# EAGLE design 4x4_keyboard_2.1 (EAGLE 9.6.2)
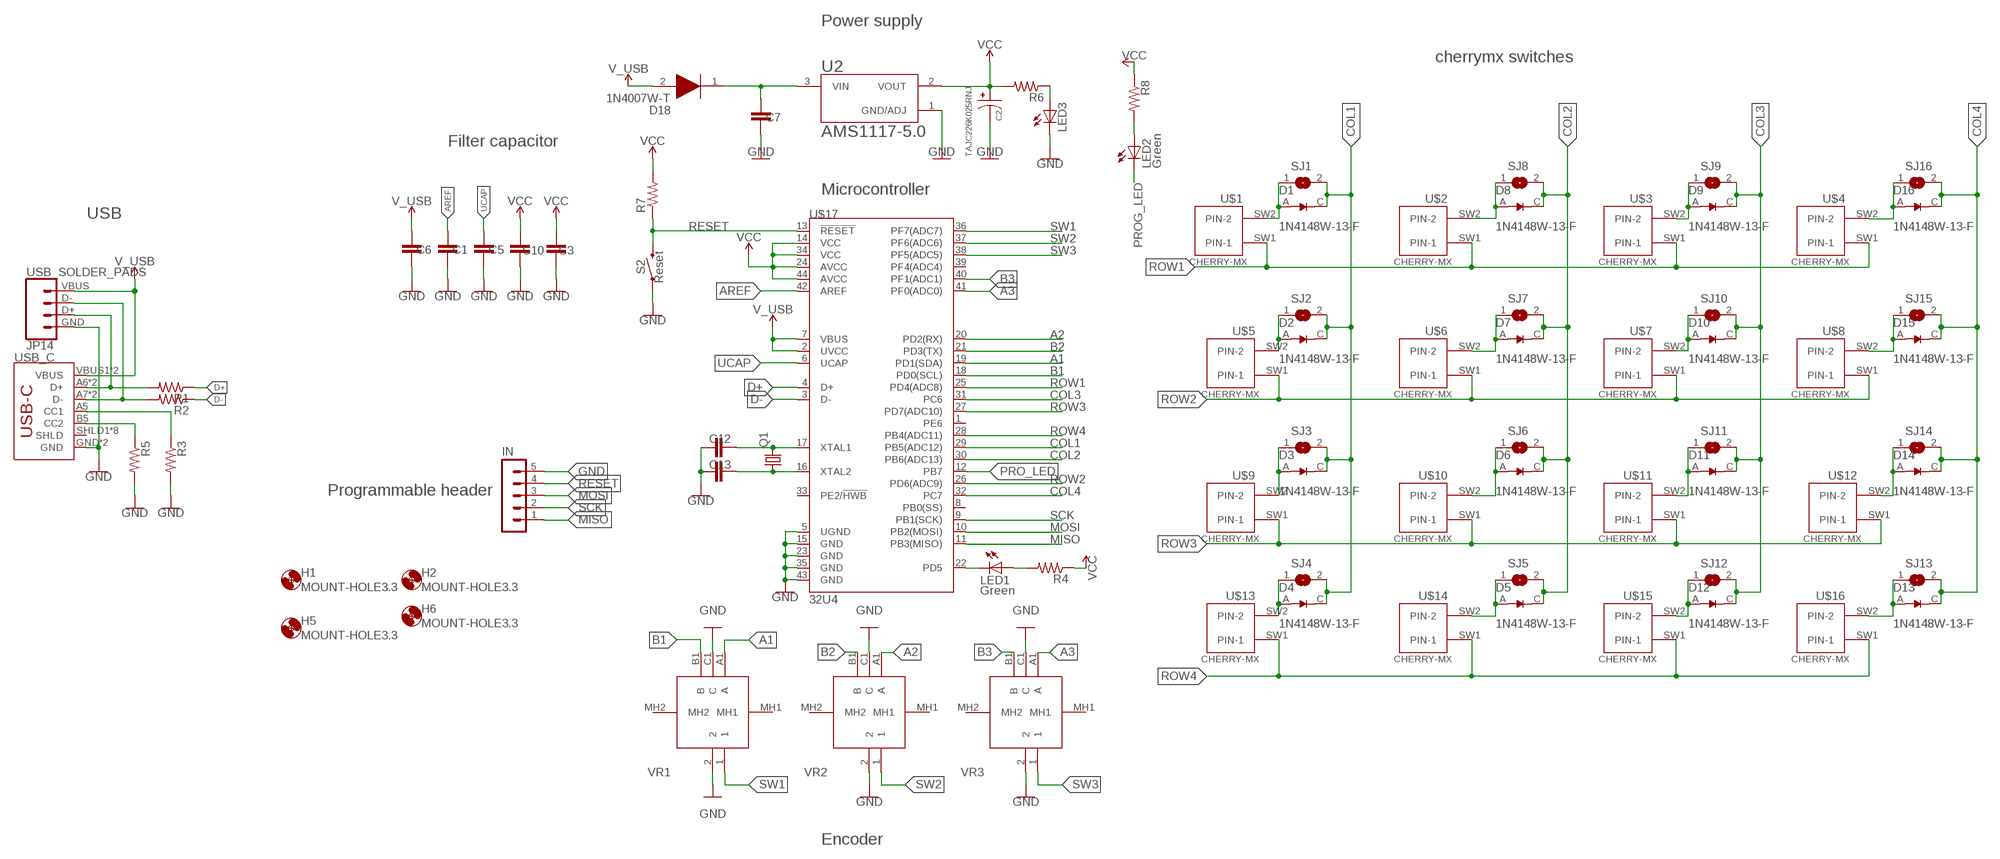
[diagram p0: schematic, sheet 1]

## Parts
C1  0.1uF  C-EUC0603  [C0603]
C2  TAJC226K025RNJ  [CAPPM6032X280N]
C3  0.1uF  C-EUC0603  [C0603]
C5  1.0uF  C-EUC0603  [C0603]
C6  1.0uF  C-EUC0603  [C0603]
C7  10uF  C-EUC0603  [C0603]
C10  1.0uF  C-EUC0603  [C0603]
C12  22pF  C-EUC0603  [C0603]
C13  22pF  C-EUC0603  [C0603]
D1  1N4148W-13-F  [SOD3715X135N]
D2  1N4148W-13-F  [SOD3715X135N]
D3  1N4148W-13-F  [SOD3715X135N]
D4  1N4148W-13-F  [SOD3715X135N]
D5  1N4148W-13-F  [SOD3715X135N]
D6  1N4148W-13-F  [SOD3715X135N]
D7  1N4148W-13-F  [SOD3715X135N]
D8  1N4148W-13-F  [SOD3715X135N]
D9  1N4148W-13-F  [SOD3715X135N]
D10  1N4148W-13-F  [SOD3715X135N]
D11  1N4148W-13-F  [SOD3715X135N]
D12  1N4148W-13-F  [SOD3715X135N]
D13  1N4148W-13-F  [SOD3715X135N]
D14  1N4148W-13-F  [SOD3715X135N]
D15  1N4148W-13-F  [SOD3715X135N]
D16  1N4148W-13-F  [SOD3715X135N]
D18  1N4007W-T  [SODFL3818X130N]
H1  MOUNT-HOLE3.3  [3,3]
H2  MOUNT-HOLE3.3  [3,3]
H5  MOUNT-HOLE3.3  [3,3]
H6  MOUNT-HOLE3.3  [3,3]
IN  MA05-1  [MA05-1]
JP14  USB_SOLDER_PADS  [USB-SOLDER-PADS]
LED1  Green  LEDSML0805  [SML0805]
LED2  Green  LEDSML0805  [SML0805]
LED3  LEDSML0805  [SML0805]
Q1  CRYSTALHC49UP  [HC49UP]
R1  5.1k  R-US_R0603  [R0603]
R2  5.1k  R-US_R0603  [R0603]
R3  5.1k  R-US_R0603  [R0603]
R4  1K  R-US_R0603  [R0603]
R5  5.1k  R-US_R0603  [R0603]
R6  1K  R-US_R0603  [R0603]
R7  1K  R-US_R0603  [R0603]
R8  1K  R-US_R0603  [R0603]
S2  Reset  MOMENTARY-SWITCH-SPST-SMD-4.6X2.8MM  [TACTILE_SWITCH_SMD_4.6X2.8MM]
SJ1  SJ  [SJ]
SJ2  SJ  [SJ]
SJ3  SJ  [SJ]
SJ4  SJ  [SJ]
SJ5  SJ  [SJ]
SJ6  SJ  [SJ]
SJ7  SJ  [SJ]
SJ8  SJ  [SJ]
SJ9  SJ  [SJ]
SJ10  SJ  [SJ]
SJ11  SJ  [SJ]
SJ12  SJ  [SJ]
SJ13  SJ  [SJ]
SJ14  SJ  [SJ]
SJ15  SJ  [SJ]
SJ16  SJ  [SJ]
U2  AMS1117-5.0  [SOT229P700X180-4N]
U$1  CHERRY-MX  [CHERRY-MX]
U$2  CHERRY-MX  [CHERRY-MX]
U$3  CHERRY-MX  [CHERRY-MX]
U$4  CHERRY-MX  [CHERRY-MX]
U$5  CHERRY-MX  [CHERRY-MX]
U$6  CHERRY-MX  [CHERRY-MX]
U$7  CHERRY-MX  [CHERRY-MX]
U$8  CHERRY-MX  [CHERRY-MX]
U$9  CHERRY-MX  [CHERRY-MX]
U$10  CHERRY-MX  [CHERRY-MX]
U$11  CHERRY-MX  [CHERRY-MX]
U$12  CHERRY-MX  [CHERRY-MX]
U$13  CHERRY-MX  [CHERRY-MX]
U$14  CHERRY-MX  [CHERRY-MX]
U$15  CHERRY-MX  [CHERRY-MX]
U$16  CHERRY-MX  [CHERRY-MX]
U$17  32U4  ATMEGA32U4TQFP-44  [TQFP44]
USB_C  USB_C5  [USB-C-16P-5]
VR1  PEC11R-4220F-S0024  [PEC11R4220FS0024]
VR2  PEC11R-4220F-S0024  [PEC11R4220FS0024]
VR3  PEC11R-4220F-S0024  [PEC11R4220FS0024]

## Nets
A1: U$17.19(PD1(SDA)) VR1.A1(A)
A2: U$17.20(PD2(RX)) VR2.A1(A)
A3: U$17.41(PF0(ADC0)) VR3.A1(A)
AREF: C1.2 U$17.42(AREF)
B1: U$17.18(PD0(SCL)) VR1.B1(B)
B2: U$17.21(PD3(TX)) VR2.B1(B)
B3: U$17.40(PF1(ADC1)) VR3.B1(B)
COL1: D1.C(K) D2.C(K) D3.C(K) D4.C(K) SJ1.2 SJ2.2 SJ3.2 SJ4.2 U$17.29(PB5(ADC12))
COL2: D5.C(K) D6.C(K) D7.C(K) D8.C(K) SJ5.2 SJ6.2 SJ7.2 SJ8.2 U$17.30(PB6(ADC13))
COL3: D9.C(K) D10.C(K) D11.C(K) D12.C(K) SJ9.2 SJ10.2 SJ11.2 SJ12.2 U$17.31(PC6)
COL4: D13.C(K) D14.C(K) D15.C(K) D16.C(K) SJ13.2 SJ14.2 SJ15.2 SJ16.2 U$17.32(PC7)
D+: R1.1 U$17.4(D+)
D-: R2.1 U$17.3(D-)
D-_HV: JP14.D- R2.2 USB_C.A7(D-) USB_C.B7(D-)
DP_HV: JP14.D+ R1.2 USB_C.A6(D+) USB_C.B6(D+)
GND: C1.1 C2.2 C3.1 C5.1 C6.1 C7.1 C10.1 C12.2 C13.2 IN.5 JP14.GND LED3.C R3.2 R5.2 S2.1 S2.2 U2.1(GND/ADJ) U$17.5(UGND) U$17.15(GND) U$17.23(GND) U$17.35(GND) U$17.43(GND) USB_C.GND USB_C.GND2(GND) VR1.2 VR1.C1(C) VR2.2 VR2.C1(C) VR3.2 VR3.C1(C)
MISO: IN.1 U$17.11(PB3(MISO))
MOSI: IN.3 U$17.10(PB2(MOSI))
N$2: LED1.C U$17.22(PD5)
N$3: D3.A SJ3.1 U$9.SW2(PIN-2)
N$4: C7.2 D18.1(K) U2.3(VIN)
N$5: LED1.A R4.2
N$6: D4.A SJ4.1 U$13.SW2(PIN-2)
N$7: R3.1 USB_C.A5(CC1)
N$8: D16.A SJ16.1 U$4.SW2(PIN-2)
N$9: D11.A SJ11.1 U$11.SW2(PIN-2)
N$10: D15.A SJ15.1 U$8.SW2(PIN-2)
N$11: LED3.A R6.1
N$12: D14.A SJ14.1 U$12.SW2(PIN-2)
N$13: R5.1 USB_C.B5(CC2)
N$14: D13.A SJ13.1 U$16.SW2(PIN-2)
N$15: D12.A SJ12.1 U$15.SW2(PIN-2)
N$16: LED2.A R8.2
N$17: D10.A SJ10.1 U$7.SW2(PIN-2)
N$19: D9.A SJ9.1 U$3.SW2(PIN-2)
N$20: D5.A SJ5.1 U$14.SW2(PIN-2)
N$21: D2.A SJ2.1 U$5.SW2(PIN-2)
N$22: D6.A SJ6.1 U$10.SW2(PIN-2)
N$23: D7.A SJ7.1 U$6.SW2(PIN-2)
N$24: C13.1 Q1.1 U$17.16(XTAL2)
N$25: D8.A SJ8.1 U$2.SW2(PIN-2)
N$26: D1.A SJ1.1 U$1.SW2(PIN-2)
N$27: C12.1 Q1.2 U$17.17(XTAL1)
PRO_LED: U$17.12(PB7)
PROG_LED: LED2.C
RESET: IN.4 R7.1 S2.3 S2.4 U$17.13(!RESET)
ROW1: U$1.SW1(PIN-1) U$2.SW1(PIN-1) U$3.SW1(PIN-1) U$4.SW1(PIN-1) U$17.25(PD4(ADC8))
ROW2: U$5.SW1(PIN-1) U$6.SW1(PIN-1) U$7.SW1(PIN-1) U$8.SW1(PIN-1) U$17.26(PD6(ADC9))
ROW3: U$9.SW1(PIN-1) U$10.SW1(PIN-1) U$11.SW1(PIN-1) U$12.SW1(PIN-1) U$17.27(PD7(ADC10))
ROW4: U$13.SW1(PIN-1) U$14.SW1(PIN-1) U$15.SW1(PIN-1) U$16.SW1(PIN-1) U$17.28(PB4(ADC11))
SCK: IN.2 U$17.9(PB1(SCK))
SW1: U$17.36(PF7(ADC7)) VR1.1
SW2: U$17.37(PF6(ADC6)) VR2.1
SW3: U$17.38(PF5(ADC5)) VR3.1
UCAP: C5.2 U$17.6(UCAP)
V_USB: C6.2 D18.2(A) JP14.VBUS U$17.2(UVCC) U$17.7(VBUS) USB_C.VBUS1(VBUS) USB_C.VBUS2(VBUS)
VCC: C2.1 C3.2 C10.2 R4.1 R6.2 R7.2 R8.1 U2.2(VOUT) U$17.14(VCC) U$17.24(AVCC) U$17.34(VCC) U$17.44(AVCC)
Unconnected: U$17.1(PE6) U$17.8(PB0(SS)) U$17.33(PE2/!HWB) U$17.39(PF4(ADC4)) USB_C.SHLD1(SHLD) USB_C.SHLD2(SHLD) USB_C.SHLD3(SHLD) USB_C.SHLD4(SHLD) USB_C.SHLD5(SHLD) USB_C.SHLD6(SHLD) USB_C.SHLD7(SHLD) USB_C.SHLD8(SHLD) VR1.MH1 VR1.MH2 VR2.MH1 VR2.MH2 VR3.MH1 VR3.MH2

## Notes on the sheet
- Power supply
- cherrymx switches
- Filter capacitor
- Microcontroller
- USB
- Programmable header
- Encoder

## Library data of the parts
C1 C3 C5-C7 C10 C12 C13 = rcl:C-EU: CAPACITOR, European symbol; SPICEPREFIX: C
C2 = TAJC226K025RNJ:TAJC226K025RNJ: 47µF Molded Tantalum Capacitors 16V 2312 (6032 Metric) 500mOhm Check availability <https://pricing.snapeda.com/parts/TAJC226K025RNJ/AVX%20Interconnect%20/%20Elco/view-part?ref=eda>; AVAILABILITY: In Stock; DESCRIPTION: 22 µF Molded Tantalum Capacitors 25 V 2312 (6032 Metric) 1.4Ohm; MF: AVX Interconnect / Elco; MP: TAJC226K025RNJ; PACKAGE: 2312 AVX Interconnect / Elco; PRICE: None; PURCHASE-URL: https://pricing.snapeda.com/search/part/TAJC226K025RNJ/?ref=eda
D1-D16 = 1N4148W-13-F:1N4148W-13-F: 1N4148W Series 2 A 100 V 400 mW Surface Mount Fast Switching Diode - SOD-123 Check prices <https://pricing.snapeda.com/parts/1N4148W-13-F/Diodes%20Inc./view-part?ref=eda>; AVAILABILITY: In Stock; DESCRIPTION: Diode Standard 100 V 150mA Surface Mount SOD-123; MF: Diodes Inc.; MP: 1N4148W-13-F; PACKAGE: SOD-123 Fairchild Semiconductor; PRICE: None; PURCHASE-URL: https://pricing.snapeda.com/search/part/1N4148W-13-F/?ref=eda
D18 = 1N4007W-T:1N4007W-T: Rectifiers SOD-123,1A,1000V,GP Source: Datasheet <https://www.mouser.cn/datasheet/2/345/1n4001w_1n4007w-2449105.pdf>; ARROW_PART_NUMBER: 1N4007W-T; ARROW_PRICE-STOCK: https://www.arrow.com/en/products/1n4007w-t/rectron?region=nac; DESCRIPTION: Rectifiers SOD-123,1A,1000V,GP; HEIGHT: 1.3mm; MANUFACTURER_NAME: Rectron; MANUFACTURER_PART_NUMBER: 1N4007W-T; MOUSER_PART_NUMBER: 583-1N4007W-T; MOUSER_PRICE-STOCK: https://www.mouser.co.uk/ProductDetail/Rectron/1N4007W-T?qs=QNEnbhJQKvah3J4JbJr%2FPw%3D%3D
H1 H2 H5 H6 = holes:MOUNT-HOLE: MOUNTING HOLE with drill center marker
IN = con-lstb:MA05-1: PIN HEADER; OC_FARNELL: unknown; OC_NEWARK: unknown
JP14 = SparkFun-Connectors:USB_SOLDER_PADS: Solder pad access to USB pins. Helpful to expose on PCBs so user can attach external USB connector if necessary.
LED1-LED3 = led:LED: LED OSRAM: - CHIPLED LG R971, LG N971, LY N971, LG Q971, LY Q971, LO R971, LY R971 LH N974, LH R974 LS Q976, LO Q976, LY Q976 LO Q996 - Hyper CHIPLED LW Q18S LB Q993, LB Q99A, LB R99A - SideLED LS A670, LO A670, LY A670, LG A670, LP A670 LB A673, LV A673, LT A673, LW A673 LH A674 LY A675 LS A676, LA A676, LO A676, LY A676, LW A676 LS A679, LY A679, LG A679 - Hyper Micro SIDELED® LS Y876, LA Y876, LO Y876, LY Y876 LT Y87S - SmartLED LW L88C, LW L88S LB L89C, LB L89S, LG L890 LS L89K, LO L89K, LY L89K LS L896, LA L896, LO L896, LY L896 - TOPLED LS T670, LO T670, LY T670, LG T670, LP T670 LSG T670, LSP T670, LSY T670, LOP T670, LYG T670 LG T671, LOG T671, LSG T671 LB T673, LV T673, LT T673, LW T673 LH T674 LS T676, LA T676, LO T676, LY T676, LB T676, LH T676, LSB T676, LW T676 LB T67C, LV T67C, LT T67C, LS T67K, LO T67K, LY T67K, LW E67C LS E67B, LA E67B, LO E67B, LY E67B, LB E67C, LV E67C, LT E67C LW T67C LS T679, LY T679, LG T679 LS T770, LO T770, LY T770, LG T770, LP T770 LB T773, LV T773, LT T773, LW T773 LH T774 LS E675, LA E675, LY E675, LS T675 LS T776, LA T776, LO T776, LY T776, LB T776 LHGB T686 LT T68C, LB T68C - Hyper Mini TOPLED® LB M676 - Mini TOPLED Santana® LG M470 LS M47K, LO M47K, LY M47K Source: http://www.osram.convergy.de LUXEON: - LUMILED® LXK2-PW12-R00, LXK2-PW12-S00, LXK2-PW14-U00, LXK2-PW14-V00 LXK2-PM12-R00, LXK2-PM12-S00, LXK2-PM14-U00 LXK2-PE12-Q00, LXK2-PE12-R00, LXK2-PE12-S00, LXK2-PE14-T00, LXK2-PE14-U00 LXK2-PB12-K00, LXK2-PB12-L00, LXK2-PB12-M00, LXK2-PB14-N00, LXK2-PB14-P00, LXK2-PB14-Q00 LXK2-PR12-L00, LXK2-PR12-M00, LXK2-PR14-Q00, LXK2-PR14-R00 LXK2-PD12-Q00, LXK2-PD12-R00, LXK2-PD12-S00 LXK2-PH12-R00, LXK2-PH12-S00 LXK2-PL12-P00, LXK2-PL12-Q00, LXK2-PL12-R00 Source: www.luxeon.com KINGBRIGHT: KA-3528ASYC Source: www.kingbright.com
Q1 = crystal:CRYSTAL: CRYSTAL; OC_FARNELL: unknown; OC_NEWARK: unknown
R1-R8 = audio amplifier example:R-US_: RESISTOR, American symbol
S2 = SparkFun-Switches:MOMENTARY-SWITCH-SPST: Momentary Switch (Pushbutton) - SPST Normally-open (NO) SPST momentary switches (buttons, pushbuttons). Variants PTH-12MM - 12mm square, through-hole Momentary Pushbutton Switch - 12mm Square <https://www.sparkfun.com/products/9190> (COM-09190) PTH-6.0MM, PTH-6.0MM-KIT - 6.0mm square, through-hole Mini Pushbutton Switch <https://www.sparkfun.com/products/97> (COM-00097) KIT package intended for soldering kit's - only one side of pads' copper is exposed. PTH-RIGHT-ANGLE-KIT - Right-angle, through-hole Right Angle Tactile Button <https://www.sparkfun.com/products/10791> - Used on SparkFun BigTime Watch Kit <https://www.sparkfun.com/products/11734> SMD-12MM - 12mm square, surface-mount Tactile Button - SMD (12mm) <https://www.sparkfun.com/products/12993> (COM-12993) Used on SparkFun PicoBoard <https://www.sparkfun.com/products/11888> SMD-4.5MM - 4.5mm Square Trackball Switch Used on SparkFun Blackberry Trackballer Breakout <https://www.sparkfun.com/products/13169> SMD-4.6MMX2.8MM - 4.60mm x 2.80mm, surface mount Used on SparkFun SAMD21 Mini Breakout <https://www.sparkfun.com/products/13664> SMD-5.2MM, SMD-5.2-REDUNDANT - 5.2mm square, surface-mount Mini Pushbutton Switch - SMD <https://www.sparkfun.com/products/8720> (COM-08720) Used on Arduino Pro Mini <https://www.sparkfun.com/products/11114> REDUNDANT package connects both switch circuits together SMD-6.0X3.5MM - 6.0 x 3.5mm, surface mount Momentary Reset Switch SMD <https://www.sparkfun.com/products/8229> (COM-08229) SMD-6.2MM-TALL - 6.2mm square, surface mount Tactile Button - SMD (6mm) <https://www.sparkfun.com/products/12992> Used on SparkFun Digital Sandbox <https://www.sparkfun.com/products/12651> SMD-RIGHT-ANGLE - Right-angle, surface mount Used on SparkFun Block for Intel® Edison - Arduino <https://www.sparkfun.com/products/13036>; PROD_ID: SWCH-13065
SJ1-SJ16 = jumper:SJ: SMD solder JUMPER
U2 = AMS1117-5.0:AMS1117-5.0: Check availability <https://pricing.snapeda.com/parts/AMS1117-5.0/Advanced%20Monolithic%20Systems/view-part?ref=eda>; AVAILABILITY: Not in stock; DESCRIPTION: Sot223/Pkg 1-Amp 5-Volt Low Drop Out Voltage Regulatator; MF: Advanced Monolithic Systems; MP: AMS1117-5.0; PACKAGE: SOT-223 Seeed Technology; PRICE: None
U$1-U$16 = cherrymx:CHERRY-MX: Cherry MX series keyswitch
U$17 = SparkFun-IC-Microcontroller:ATMEGA32U4: Atmel MCU, 32KByte Atmel 44-pin 8-bit Microcontroller with 32KBytes of ISP Flash and USB Controller Datasheet <http://cdn.sparkfun.com/datasheets/Dev/Arduino/Boards/ATMega32U4.pdf> SparkFun Products LilyPad Arduino USB - ATmega32U4 Board <https://www.sparkfun.com/products/12049> (DEV-12049) Pro Micro - 5V/16MHz <https://www.sparkfun.com/products/12640> (DEV-12640) Pro Micro - 3.3V/8MHz <https://www.sparkfun.com/products/12587> (DEV-12587) Fio v3 - ATmega32U4 <https://www.sparkfun.com/products/11520> (DEV-11520) Qduino Mini <https://www.sparkfun.com/products/13614> (DEV-13614) Makey Makey - Standard Kit <https://www.sparkfun.com/products/11511> (WIG-11511) Makey Makey Deluxe Kit <https://www.sparkfun.com/products/11519> (WIG-11519); PROD_ID: IC-11161
USB_C = USBC:USB_C: USB Type C 16Pin Connector Super Speed pins not available on the 16-pin purely SMD connector so this part is best for USB 2.0 implementations. D1 and D2 are tied together enabling D+/- no matter which way the cable is plugged into the connector. The two channel configuration pins (CC1/2) are exposed. These are normally connected to ground via 5.1k resistors but can be reconfigured for high current/high power applications.
VR1-VR3 = PEC11R-4220F-S0024-RotaryEncoder:PEC11R-4220F-S0024: Bourns 24 Pulse Incremental Mechanical Rotary Encoder with a 6 mm Flat Shaft (Not Indexed), Through Hole Source: Datasheet <http://uk.rs-online.com/web/p/products/7377767P>; ALLIED_NUMBER: 70276555; DESCRIPTION: Bourns 24 Pulse Incremental Mechanical Rotary Encoder with a 6 mm Flat Shaft (Not Indexed), Through Hole; HEIGHT: 27.5mm; MANUFACTURER_NAME: Bourns; MANUFACTURER_PART_NUMBER: PEC11R-4220F-S0024; RS_PART_NUMBER: 7377767P; RS_PRICE-STOCK: http://uk.rs-online.com/web/p/products/7377767P

## Board
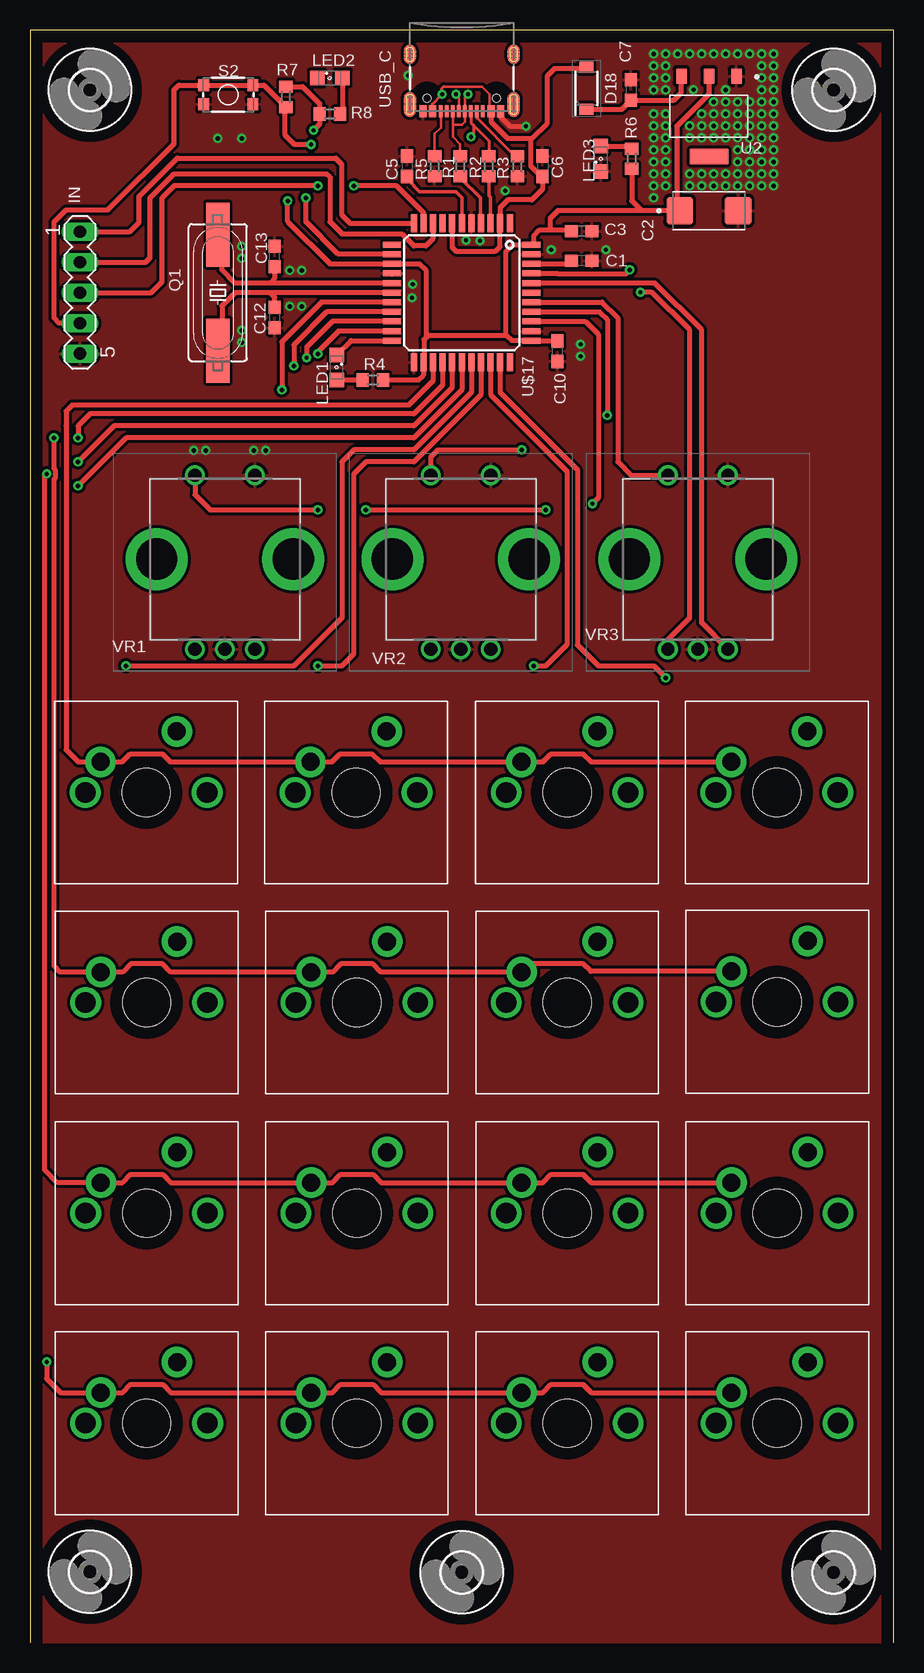
[diagram p1: board, top side]
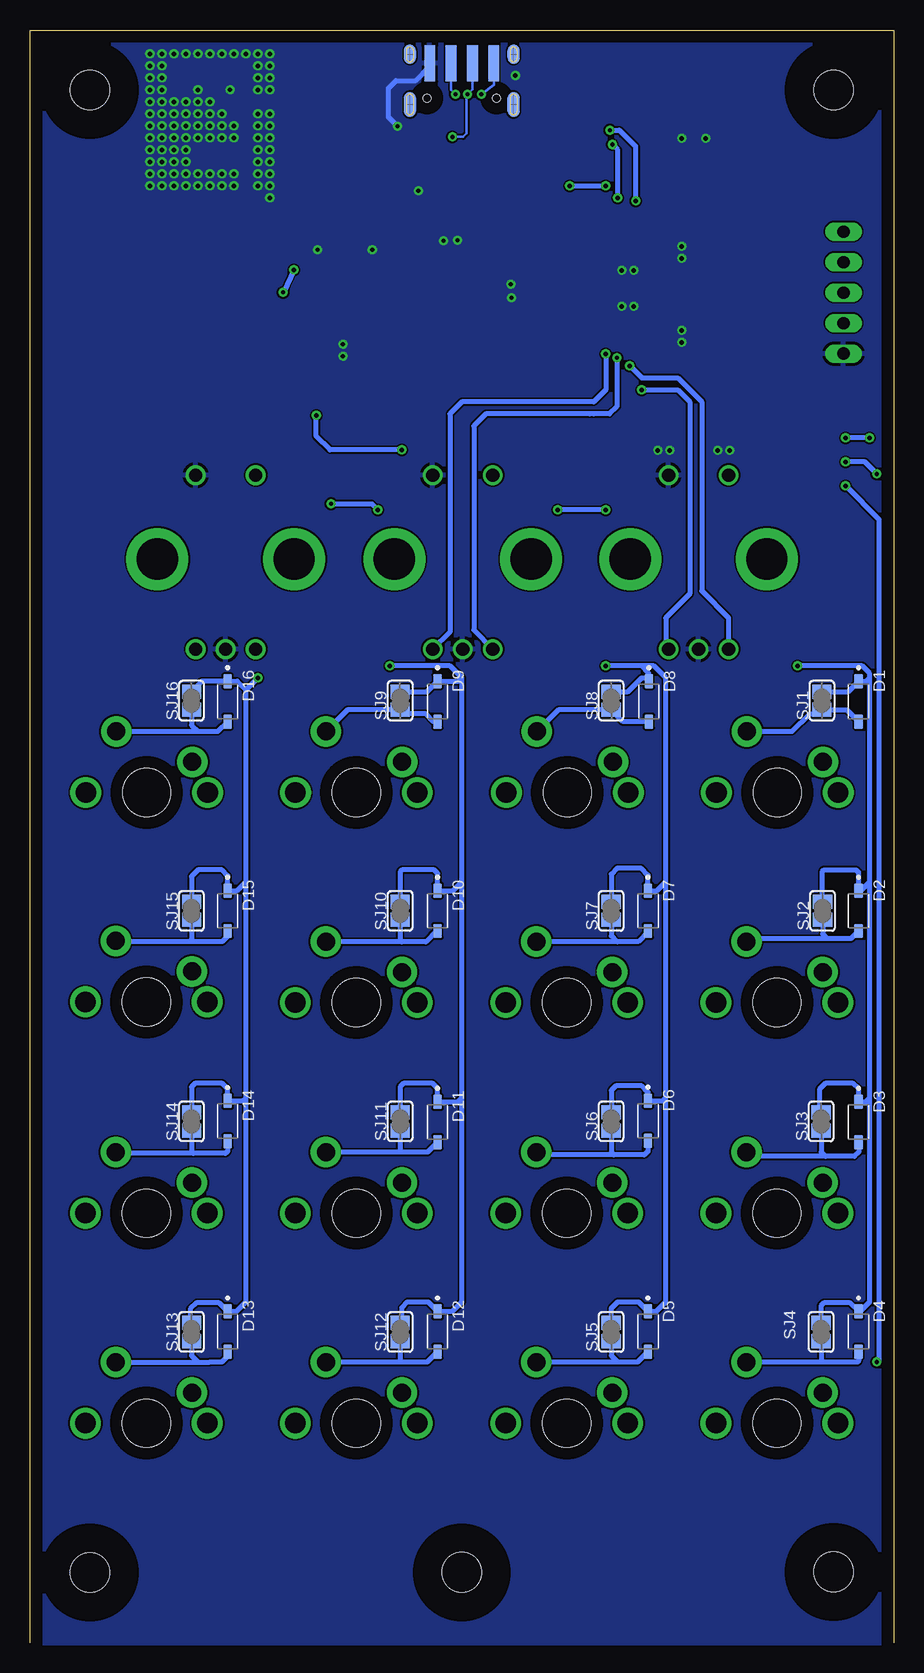
[diagram p2: board, bottom side, seen from below]

Size 72 x 134.4 mm. Coordinates in mm from the lower left corner, seen from the top.
Outline: 72,0 72,134.4 0,134.4 0,0
Copper layers (1*16): Top 0.035mm / dielectric 1.5mm / Bottom 0.035mm
Design rules "default": minimum track width 6mil, minimum drill 0.35mm, track to track 6mil, track to pad 6mil, pad to pad 6mil, via to via 6mil, smd to smd 6mil, copper to edge 40mil, drill to drill 6mil, minimum pad ring 10mil, minimum via ring 8mil, stop-mask expansion 4mil, vias tented up to drill 0mil, thermal gap 10mil

### Footprints (pad centres in the part's own frame; a part is rotated, then mirrored left to right if it is on the bottom)
C0603 = smd 1.1 x 1: 1 -0.85,0; 2 0.85,0
CAPPM6032X280N = smd 2.24 x 2.32: 1 -2.435,0; 2 2.435,0
SOD3715X135N = smd 1.21 x 0.73: A 1.68,0; C -1.68,0
SODFL3818X130N = smd 0.92 x 1.13: 1 -1.75,0; 2 1.75,0
3,3 = hole 3.3: 0,0
MA05-1 = drill 1.016 long: 1 -5.08,0; 2 -2.54,0; 3 0,0; 4 2.54,0; 5 5.08,0
USB-SOLDER-PADS = smd 3 x 0.9: D+ 0,-0.889; D- 0,0.889; GND 0,-2.667; VBUS 0,2.667
SML0805 = smd 1.2 x 1.2: A 1.05,0; C -1.05,0
HC49UP = smd 5.334 x 1.93: 1 -4.826,0; 2 4.826,0
R0603 = smd 1 x 1.1: 1 -0.85,0; 2 0.85,0
TACTILE_SWITCH_SMD_4.6X2.8MM = smd 0.9 x 1: 1 -2.05,-0.8; 2 2.05,-0.8; 3 2.05,0.8; 4 -2.05,0.8
SJ = smd 1.168 x 1.6: 1 -0.762,0; 2 0.762,0
SOT229P700X180-4N = smd 0.93 x 1.31: 1 -2.29,-3.345; 2 0,-3.345; 3 2.29,-3.345 | smd 3.24 x 1.31: 4 0,3.345
CHERRY-MX = drill 1.714 pad 1.93: P$3 -5.08,0; P$4 5.08,0 | drill 1.5 pad 2.54: SW1 -3.81,2.54; SW2 2.54,5.08 | hole 4: 0,0
TQFP44 = smd 1.5 x 0.5: 1 -5.8,4; 2 -5.8,3.2; 3 -5.8,2.4; 4 -5.8,1.6; 5 -5.8,0.8; 6 -5.8,0; 7 -5.8,-0.8; 8 -5.8,-1.6; 9 -5.8,-2.4; 10 -5.8,-3.2; 11 -5.8,-4; 23 5.8,-4; 24 5.8,-3.2; 25 5.8,-2.4; 26 5.8,-1.6; 27 5.8,-0.8; 28 5.8,0; 29 5.8,0.8; 30 5.8,1.6; 31 5.8,2.4; 32 5.8,3.2; 33 5.8,4 | smd 0.5 x 1.5: 12 -4,-5.8; 13 -3.2,-5.8; 14 -2.4,-5.8; 15 -1.6,-5.8; 16 -0.8,-5.8; 17 0,-5.8; 18 0.8,-5.8; 19 1.6,-5.8; 20 2.4,-5.8; 21 3.2,-5.8; 22 4,-5.8; 34 4,5.8; 35 3.2,5.8; 36 2.4,5.8; 37 1.6,5.8; 38 0.8,5.8; 39 0,5.8; 40 -0.8,5.8; 41 -1.6,5.8; 42 -2.4,5.8; 43 -3.2,5.8; 44 -4,5.8
USB-C-16P-5 = smd 0.3 x 1: A5 -1.25,-0.34; A6 -0.25,-0.34; A7 0.25,-0.34; A8 1.25,-0.34; B5 1.75,-0.34; B6 0.75,-0.34; B7 -0.75,-0.34; B8 -1.75,-0.34 | smd 0.6 x 1: GND -3.225,-0.34; GND2 3.225,-0.34; VBUS1 -2.45,-0.34; VBUS2 2.45,-0.34 | smd 1 x 2.1: SHLD1 -4.32,-0.915; SHLD2 4.32,-0.915 | smd 1 x 2.1 bottom: SHLD3 -4.32,-0.915; SHLD4 4.32,-0.915 | smd 1 x 1.6: SHLD5 -4.32,-5.095; SHLD8 4.32,-5.095 | smd 1 x 1.6 bottom: SHLD6 -4.32,-5.095; SHLD7 4.32,-5.095 | hole 0.65: -2.89,-1.445; 2.89,-1.445
PEC11R4220FS0024 = drill 1.1 pad 1.65: 1 0,0; 2 5,0; A1 0,-14.5; B1 5,-14.5; C1 2.5,-14.5 | drill 3.441 pad 5.161: MH1 -3.2,-7; MH2 8.2,-7

### Placement (x,y rotation side)
C1  46,115.19 180 top
C2  56.61,119.34 0 top
C3  46,117.64 180 top
C5  31.43,123.05 270 top
C6  42.73,123.05 270 top
C7  50.11,129.41 270 top
C10  43.97,107.63 90 top
C12  20.4,110.45 270 top
C13  20.4,115.53 90 top
D1  2.92,78.45 270 bottom
D2  2.92,61 270 bottom
D3  2.92,43.4 270 bottom
D4  2.92,25.94 270 bottom
D5  20.48,25.94 270 bottom
D6  20.48,43.51 270 bottom
D7  20.48,61 270 bottom
D8  20.4,78.45 270 bottom
D9  38.02,78.45 270 bottom
D10  38.02,61 270 bottom
D11  38.02,43.41 270 bottom
D12  38.02,25.94 270 bottom
D13  55.52,25.94 270 bottom
D14  55.52,43.48 270 bottom
D15  55.52,61 270 bottom
D16  55.52,78.45 270 bottom
D18  46.4,129.54 90 top
H1  67,129.41 0 top
H2  5,129.41 0 top
H4  MOUNT-HOLE3.3  [3,3]  67,5.86 0 top
H5  5,5.92 0 top
H6  36,5.87 0 top
IN  4.17,112.52 270 top
JP14  36,131.62 270 bottom
LED1  25.57,106.27 270 top
LED2  25,130.41 0 top
LED3  47.59,123.67 90 top
Q1  15.66,112.52 270 top
R1  35.87,123.05 90 top
R2  38.25,123.05 90 top
R3  40.63,123.05 270 top
R4  28.59,105.24 180 top
R5  33.75,123.05 270 top
R6  50.17,123.67 270 top
R7  21.34,128.83 90 top
R8  25,127.41 0 top
S2  16.53,129.01 0 top
SJ1  5.97,78.51 90 bottom
SJ2  5.91,61 90 bottom
SJ3  6.04,43.45 90 bottom
SJ4  6.04,25.91 90 bottom
SJ5  23.54,25.91 90 bottom
SJ6  23.54,43.45 90 bottom
SJ7  23.54,61 90 bottom
SJ8  23.54,78.51 90 bottom
SJ9  41.13,78.51 90 bottom
SJ10  41.13,61 90 bottom
SJ11  41.13,43.45 90 bottom
SJ12  41.13,25.91 90 bottom
SJ13  58.53,25.91 90 bottom
SJ14  58.53,43.45 90 bottom
SJ15  58.53,61 90 bottom
SJ16  58.53,78.51 90 bottom
U2  56.61,127.21 180 top
U$1  9.69,70.86 0 top
U$2  27.2,70.86 0 top
U$3  44.78,70.86 0 top
U$4  62.27,70.86 0 top
U$5  9.72,53.36 0 top
U$6  27.25,53.36 0 top
U$7  44.79,53.36 0 top
U$8  62.3,53.41 0 top
U$9  9.72,35.81 0 top
U$10  27.25,35.81 0 top
U$11  44.79,35.81 0 top
U$12  62.3,35.81 0 top
U$13  9.72,18.31 0 top
U$14  27.25,18.31 0 top
U$15  44.79,18.31 0 top
U$16  62.3,18.31 0 top
U$17  36,112.52 270 top
USB_C  36,127.28 180 top
VR1  13.75,97.31 0 top
VR2  33.42,97.31 0 top
VR3  53.18,97.31 0 top

### Tracks (layer width: path | path; a pad name or v marks a point on that pad's centre or on a via)
A1  (via drill 0.35)
  Top 0.406: U$17.19 24.75,110.92 22,108.17 v22,106.41
  Bottom 0.406: VR1.A1 13.75,85.41 16,87.66 16,103.41 18,105.41 21,105.41 v22,106.41
A2  (via drill 0.35)
  Top 0.406: v23.07,107.08 23.07,107.97 25.22,110.12 U$17.20
  Bottom 0.406: VR2.A1 35,84.39 35,101.41 34,102.41 25.35,102.41 25,102.41 23.67,102.41 23.07,103.01 v23.07,107.08
A3  (via drill 0.35)
  Top 0.406: VR3.A1 53.18,83.59 55,85.41 55,109.41 51.87,112.54 v50.91,112.54 | U$17.41 43.99,114.12 44.03,114.08 49.67,114.08 v50,114.41
  Bottom 0.406: v50.91,112.54 50.87,112.54 v50,114.41
AREF
  Top 0.406: U$17.42 44.7,114.92 C1.2
B1  (via drill 0.35)
  Top 0.406: U$17.18 24.31,111.72 21,108.41 v21,104.41
  Bottom 0.406: VR1.B1 19,83.05 19,85.41 17,87.41 17,103.41 18,104.41 v21,104.41
B2  (via drill 0.35)
  Top 0.406: v24,107.41 24,107.6 25.72,109.32 U$17.21
  Bottom 0.406: v24,107.41 24,104.41 25,103.41 36,103.41 37,102.41 37,84.23 VR2.B1
B3
  Top 0.406: VR3.B1 56,84.99 56,109.41 52.09,113.32 U$17.40
COL1  (via drill 0.35)
  Top 0.406: v8,81.41 22,81.41 26,85.41 26,98.41 27,99.41 32,99.41 36.8,104.21 U$17.29
  Bottom 0.406: SJ1.2 3.78,79.27 D1.C 2.28,80.13 2,80.41 | SJ2.2 5.92,61.77 5.92,64.28 5.79,64.41 3.13,64.41 2.92,64.19 D2.C 2.73,62.68 2,63.41 | SJ3.2 6.18,44.36 6.18,46.12 5.67,46.63 3.38,46.63 2.92,46.16 D3.C 2.33,45.08 2,45.41 | SJ4.2 6.05,26.69 6.05,28.08 5.79,28.34 3.63,28.34 D4.C 2.79,27.62 2,28.41 2,45.41 | 2,45.41 2,63.41 | 2,63.41 2,80.41 | 2,80.41 2,80.79 2.62,81.41 v8,81.41
COL2  (via drill 0.35)
  Top 0.406: v24,81.41 26,81.41 27,82.41 27,97.41 28,98.41 32,98.41 37.6,104.01 U$17.30
  Bottom 0.406: SJ8.2 22.14,79.27 21,80.41 20.68,80.41 D8.C 20.4,80.81 21,81.41 | SJ5.2 23.54,27.87 23,28.41 21.27,28.41 D5.C 19.79,27.62 19,28.41 19,45.41 | SJ6.2 23.54,46.03 23.16,46.41 21,46.41 20.48,45.88 D6.C 19.22,45.19 19,45.41 | SJ7.2 23.54,64.06 23.07,64.53 21.04,64.53 20.48,63.97 D7.C 19.73,62.68 19,63.41 | 19,45.41 19,63.41 | 19,63.41 19,80.41 20,81.41 21,81.41 | 21,81.41 v24,81.41
COL3  (via drill 0.35)
  Top 0.406: U$17.31 38.4,104.01 44.76,97.65 44.76,83.17 43,81.41 v42,81.41
  Bottom 0.406: SJ9.2 38.88,79.27 D9.C 36.28,80.13 36,80.41 | SJ12.2 41,26.81 41,27.93 40.52,28.41 38.81,28.41 D12.C 36.79,27.62 36,28.41 36,45.41 | SJ10.2 41.13,64.25 40.97,64.41 38.31,64.41 38.02,64.12 D10.C 36.73,62.68 36,63.41 | SJ11.2 41.13,46.34 40.85,46.63 38.43,46.63 38.02,46.21 D11.C 36.33,45.08 36,45.41 | 36,45.41 36,63.41 | 36,63.41 36,80.41 | 36,80.41 37,81.41 v42,81.41
COL4  (via drill 0.35)
  Top 0.406: U$17.32 39.2,104.21 45.63,97.78 45.63,83.17 47.4,81.41 52,81.41 v53,80.41
  Bottom 0.406: SJ16.2 57.67,80.13 D16.C 54.72,80.13 54,79.41 | SJ13.2 58.63,26.77 58.63,27.83 58.12,28.34 56.24,28.34 D13.C 54.79,27.62 54,28.41 54,45.41 | SJ14.2 58.53,46.34 58.25,46.63 55.96,46.63 55.52,46.19 D14.C 54.25,45.16 54,45.41 | SJ15.2 58.53,63.88 58,64.41 56,64.41 55.52,63.93 D15.C 54.73,62.68 54,63.41 | 54,45.41 54,63.41 | 54,63.41 54,79.41 | 54,79.41 v53,80.41
D+
  Top 0.305: U$17.4 37.55,118.37 37.55,120.41 35.87,122.09 R1.1
D-
  Top 0.305: R2.1 38.25,120.59 38.4,120.45 U$17.3
D-_HV  (via drill 0.35)
  Top 0.2: USB_C.A7 35.77,127.64 35.77,128.79 v35.51,129.05
  Top 0.254: USB_C.B7 36.78,127.59 36.78,126.64 37.01,126.41 | R2.2 38.25,125.16 37.01,126.41 | v36.78,125.49 37.01,125.71 37.01,126.41
  Bottom 0.2: JP14.D- 35.11,129.45 v35.51,129.05 35.59,128.97 35.59,125.79 35.89,125.49 v36.78,125.49
DP_HV  (via drill 0.35)
  Top 0.2: v36.53,129.05 36.25,128.77 USB_C.A6 36.25,126.74 36.02,126.51 35.39,126.51 35.25,126.65 | 35.25,126.65 USB_C.B6 | 35.25,126.65 35.25,125.5 35.87,124.88 R1.2
  Bottom 0.2: JP14.D+ 36.89,129.41 v36.53,129.05
GND  (via drill 0.35)
  Top 0.152: USB_C.GND 39.23,127.16
  Top 0.406: v41.35,126.38 40,126.38 39.23,127.16
  Bottom 0.406: JP14.GND 38.67,131.36 39.83,130.19 41.48,130.19 42.12,129.56 42.12,127.14 v41.35,126.38
  other vias: 52,127.41 52,126.41 52,125.41 52,124.41 31.53,130.61 52,123.41 52,122.41 52,121.41 53,121.41 53,122.41 53,123.41 53,124.41 53,125.41 53,126.41 53,127.41 53,129.41 53,130.41 53,131.41 53,132.41 52,132.41 52,131.41 52,130.41 52,129.41 54,132.41 55,132.41 56,132.41 57,132.41 58,132.41 59,132.41 60,132.41 61,132.41 61,130.41 61,131.41 61,129.41 61,128.41 61,127.41 61,126.41 61,125.41 61,124.41 61,123.41 61,122.41 61,121.41 60,121.41 59,121.41 58,121.41 57,121.41 56,121.41 55,121.41 55,122.41 56,122.41 57,122.41 58,122.41 59,122.41 60,122.41 60,123.41 59,123.41 59,124.41 59,125.41 59,126.41 59,127.41 59,128.41 60,128.41 60,127.41 60,126.41 60,125.41 60,124.41 58,125.41 57,125.41 56,125.41 55,125.41 55,126.41 56,126.41 57,126.41 58,126.41 58,127.41 57,127.41 56,127.41 57,128.41 58,128.41 58,129.41 36.36,116.88 37.52,116.83 48.03,116.09 43.46,116.09 31.91,113.21 31.87,112.09 21.66,114.37 22.66,114.37 21.66,111.37 22.66,111.37 17.66,108.37 17.66,109.37 18.66,99.37 14.66,99.37 13.66,99.37 19.66,99.37 45.91,108.21 45.91,107.21 15.66,125.37 17.66,125.37 39.62,121 17.66,115.37 17.66,116.37 62,132.41 62,131.41 62,130.41 62,129.41 62,128.41 62,127.41 62,126.41 62,125.41 62,124.41 62,123.41 62,122.41 62,121.41 55.33,129.43 52,120.41
  pour Bottom: 0,134.41 72,134.41 72,0 0,0
  pour Top (isolate 0.254): 0,134.41 72,134.41 72,132.41 72,0.02 64.98,0.02 0,0.02 0,1.41
MISO
  Top 0.406: IN.1 8.31,117.6 9.1,118.38 9.1,120.54 12.27,123.72 25.48,123.72 25.99,123.21 25.99,119.02 26.69,118.32 U$17.11
MOSI  (via drill 0.35)
  Top 0.406: U$17.10 32.8,119.19 30.58,121.41 v27,121.41 | IN.3 10.11,112.52 11,113.41 11,120.41 12,121.41 v24,121.41
  Bottom 0.406: v27,121.41 v24,121.41
N$2
  Top 0.406: LED1.C 26.76,108.52 U$17.22
N$3
  Bottom 0.406: D3.A 2.92,40.87 3.26,40.53 5.67,40.53 | 5.67,40.53 11.9,40.53 U$9.SW2 | SJ3.1 6.04,40.9 5.67,40.53
N$4
  Top 0.406: U2.3 54.31,130.54 54.31,129.18 53.69,128.56 C7.2 49.34,127.79 D18.1
N$5
  Top 0.406: LED1.A 25.59,105.24 R4.2
N$6
  Bottom 0.406: D4.A 2.92,23.5 3.02,23.39 6,23.39 | 6,23.39 U$13.SW2 | SJ4.1 6.04,23.43 6,23.39
N$7
  Top 0.254: USB_C.A5 37.25,127.08 40.43,123.9 R3.1
N$8
  Bottom 0.406: U$4.SW2 58,75.94 | 58,75.94 56.35,75.94 D16.A | SJ16.1 58.53,76.48 58,75.94
N$9
  Bottom 0.406: D11.A 38.02,41.71 38.84,40.89 41,40.89 | 41,40.89 U$11.SW2 | SJ11.1 41.13,41.02 41,40.89
N$10
  Bottom 0.406: D15.A 55.52,58.88 55.96,58.44 58.37,58.44 | 58.37,58.44 64.79,58.44 U$8.SW2 | SJ15.1 58.53,58.6 58.37,58.44
N$11
  Top 0.406: LED3.A 49.97,124.72 R6.1
N$12
  Bottom 0.406: D14.A 55.52,40.97 55.71,40.78 58.37,40.78 | 58.37,40.78 64.73,40.78 U$12.SW2 | SJ14.1 58.53,40.94 58.37,40.78
N$13
  Top 0.2: USB_C.B5 34.25,126.26 33.75,125.76 R5.1
N$14
  Bottom 0.406: U$16.SW2 58,23.39 | 58,23.39 57.02,23.39 57,23.41 56,23.41 55.52,23.89 D13.A | SJ13.1 58.53,23.92 58,23.39
N$15
  Bottom 0.406: D12.A 38.89,23.39 41,23.39 | 41,23.39 U$15.SW2 | SJ12.1 41.13,23.52 41,23.39
N$16
  Top 0.406: LED2.A 26.05,127.61 R8.2
N$17
  Bottom 0.406: D10.A 38.09,59.32 39,58.41 41,58.41 | 41,58.41 47.3,58.41 U$7.SW2 | SJ10.1 41.13,58.54 41,58.41
N$19
  Bottom 0.406: D9.A 38.36,76.77 39,77.41 40.8,77.41 SJ9.1 45.52,77.75 U$3.SW2
N$20
  Bottom 0.406: D5.A 21.34,23.39 23,23.39 | 23,23.39 U$14.SW2 | SJ5.1 23.54,23.93 23,23.39
N$21
  Bottom 0.406: D2.A 3.54,58.69 5.54,58.69 | U$5.SW2 12.01,58.69 5.54,58.69 | SJ2.1 5.91,59.06 5.54,58.69
N$22
  Bottom 0.406: D6.A 20.48,40.96 20.78,40.66 23.32,40.66 | 23.32,40.66 29.56,40.66 U$10.SW2 | SJ6.1 23.54,40.87 23.32,40.66
N$23
  Bottom 0.406: SJ7.1 23.54,58.91 23.07,58.44 | D7.A 20.48,59.25 21.29,58.44 23,58.44 23.07,58.44 | 23.07,58.44 U$6.SW2
N$24
  Top 0.406: U$17.16 20,113.32 | 20,113.32 17.09,113.32 16,114.41 16,117 Q1.1 | C13.1 20.4,113.72 20,113.32
N$25
  Bottom 0.406: D8.A 22.56,76.77 SJ8.1 27.93,77.75 U$2.SW2
N$26
  Bottom 0.406: U$1.SW2 8.47,75.94 7,77.41 6.3,77.41 SJ1.1 3.89,77.75 D1.A
N$27
  Top 0.406: U$17.17 20,112.52 | 20,112.52 17.11,112.52 16,111.41 16,108.03 Q1.2 | C12.1 20.4,112.12 20,112.52
RESET  (via drill 0.35)
  Top 0.406: IN.4 2.43,109.98 2,110.41 2,118.41 3,119.41 6.49,119.41 12,124.92 12,129.41 12.4,129.81 S2.4 S2.3 19.51,129.81 R7.1 21.34,127.73 21.29,127.68 21.29,125.62 22.05,124.86 v23.45,124.86 | U$17.13 25.69,115.72 23,118.41 v23,120.41
  Bottom 0.406: v23,120.41 23,124.41 v23.45,124.86
ROW1
  Top 0.406: U$4.SW1 46.8,73.4 46.12,74.08 43.45,74.08 42.77,73.4 U$3.SW1 29.21,73.4 28.53,74.08 25.86,74.08 25.18,73.4 U$2.SW1 11.7,73.4 11.02,74.08 8.36,74.08 7.68,73.4 U$1.SW1 4,73.41 3,74.41 3,101.41 3,102.63 3.51,103.14 31.58,103.14 33.6,105.16 U$17.25
ROW2  (via drill 0.35)
  Top 0.406: v2,100.41 2,97.84 2.13,97.71 2.13,97.11 2,96.98 2,56.41 2.51,55.9 U$5.SW1 7.71,55.9 8.39,56.58 11.06,56.58 11.73,55.9 U$6.SW1 25.24,55.9 25.92,56.58 28.58,56.58 29.26,55.9 U$7.SW1 41.66,56.58 46.12,56.58 46.75,55.95 U$8.SW1 | U$17.26 34.4,104.81 32,102.41 5,102.41 4,101.41 v4,100.41
  Bottom 0.406: v2,100.41 v4,100.41
ROW3  (via drill 0.35)
  Top 0.406: v1.39,97.41 1.22,97.23 1.22,39.41 2.28,38.35 U$9.SW1 7.71,38.35 8.39,39.03 11.06,39.03 11.73,38.35 U$10.SW1 25.24,38.35 25.92,39.03 28.58,39.03 29.26,38.35 U$11.SW1 42.78,38.35 43.46,39.03 46.12,39.03 46.8,38.35 U$12.SW1 | U$17.27 35.2,104.61 32,101.41 7,101.41 v4,98.41
  Bottom 0.406: v1.39,97.41 2.39,98.41 v4,98.41
ROW4  (via drill 0.35)
  Top 0.406: v1.39,23.41 1.39,22.02 2.56,20.85 U$13.SW1 7.71,20.85 8.39,21.53 11.06,21.53 11.73,20.85 U$14.SW1 25.24,20.85 25.92,21.53 28.58,21.53 29.26,20.85 U$15.SW1 42.78,20.85 43.46,21.53 46.12,21.53 46.8,20.85 U$16.SW1 | U$17.28 36,104.41 32,100.41 8,100.41 v4,96.41
  Bottom 0.406: v4,96.41 1.22,93.63 1.22,23.41 v1.39,23.41
SCK
  Top 0.406: IN.2 9.65,115.06 10,115.41 10,120.41 12,122.41 24.75,122.41 25,122.16 25,118.41 26,117.41 31,117.41 32,116.41 33,116.41 33.6,117.01 U$17.9
SW1  (via drill 0.35)
  Top 0.406: U$17.36 46.29,110.12 47.38,109.03 47.38,95.41 v46.89,94.92 | VR1.1 13.75,95.66 15,94.41 v24,94.41 | v28,94.41 v43,94.41
  Bottom 0.406: v24,94.41 v28,94.41 | v46.89,94.92 43.51,94.92 v43,94.41
SW2  (via drill 0.35)
  Top 0.406: U$17.37 47.49,110.92 48.13,110.28 v48.13,102.28 | VR2.1 33.42,98.83 34,99.41 v41,99.41
  Bottom 0.406: v48.13,102.28 48.13,100.54 47,99.41 v41,99.41
SW3
  Top 0.406: U$17.38 47.69,111.72 49,110.41 49,98.41 50.1,97.31 VR3.1
UCAP
  Top 0.305: C5.2 31.84,121.57 32,121.41 32,121.39 32.47,120.92 35.51,120.92 36.02,120.41 36.02,118.34 U$17.6
V_USB  (via drill 0.35)
  Top 0.2: 34.5,129.68 37.67,129.68 38.31,129.05 38.31,127.77 USB_C.VBUS1 | USB_C.VBUS2 33.55,128.1
  Top 0.254: 34.5,129.68 34.37,129.56 v34.37,129.05 33.55,128.23 33.55,128.1
  Top 0.406: U$17.7 35.2,116.28 35.51,115.97 38.81,115.97 39.2,116.35 U$17.2 39.2,119.61 39.84,120.25 41.84,120.25 42.73,121.15 C6.2 | C6.2 | 41.74,125.37 41.74,123.08 42.62,122.19 C6.2 | USB_C.VBUS1 38.45,126.75 39.83,125.37 41.74,125.37 | 41.74,125.37 41.86,125.37 43.13,126.64 43.13,130.57 43.77,131.21 46.32,131.21 D18.2
  Bottom 0.2: v34.37,129.05 33.33,129.83 JP14.VBUS
VCC  (via drill 0.35)
  Top 0.406: 39.7,108.98 40.17,108.52 U$17.34 43.97,108.52 C10.2 | 39.7,108.98 39.7,115.97 40.21,116.48 41.76,116.48 U$17.44 42,116.52 42,117.25 42.5,117.75 43.39,117.75 | 39.7,108.98 33.23,108.98 33,108.76 | R4.1 32.41,105.24 32.8,105.63 U$17.24 32.85,106.76 32.85,108.6 33,108.76 | U2.2 56.61,129.06 53.93,126.38 53.93,119.59 C2.1 51,119.34 | 51,119.34 44,119.34 43.37,118.66 43.37,117.77 43.39,117.75 | 33,108.76 33,114.41 32.49,114.92 U$17.14 25.01,114.92 21.49,118.43 v21.49,120.16 | R6.2 50.17,120.17 51,119.34 | 43.39,117.75 45.04,117.75 C3.2 | R7.2 22.73,129.68 24.15,128.26 R8.1 24.15,126.56 v23.65,126.06
  Bottom 0.406: v21.49,120.16 21.49,124.68 22.87,126.06 v23.65,126.06